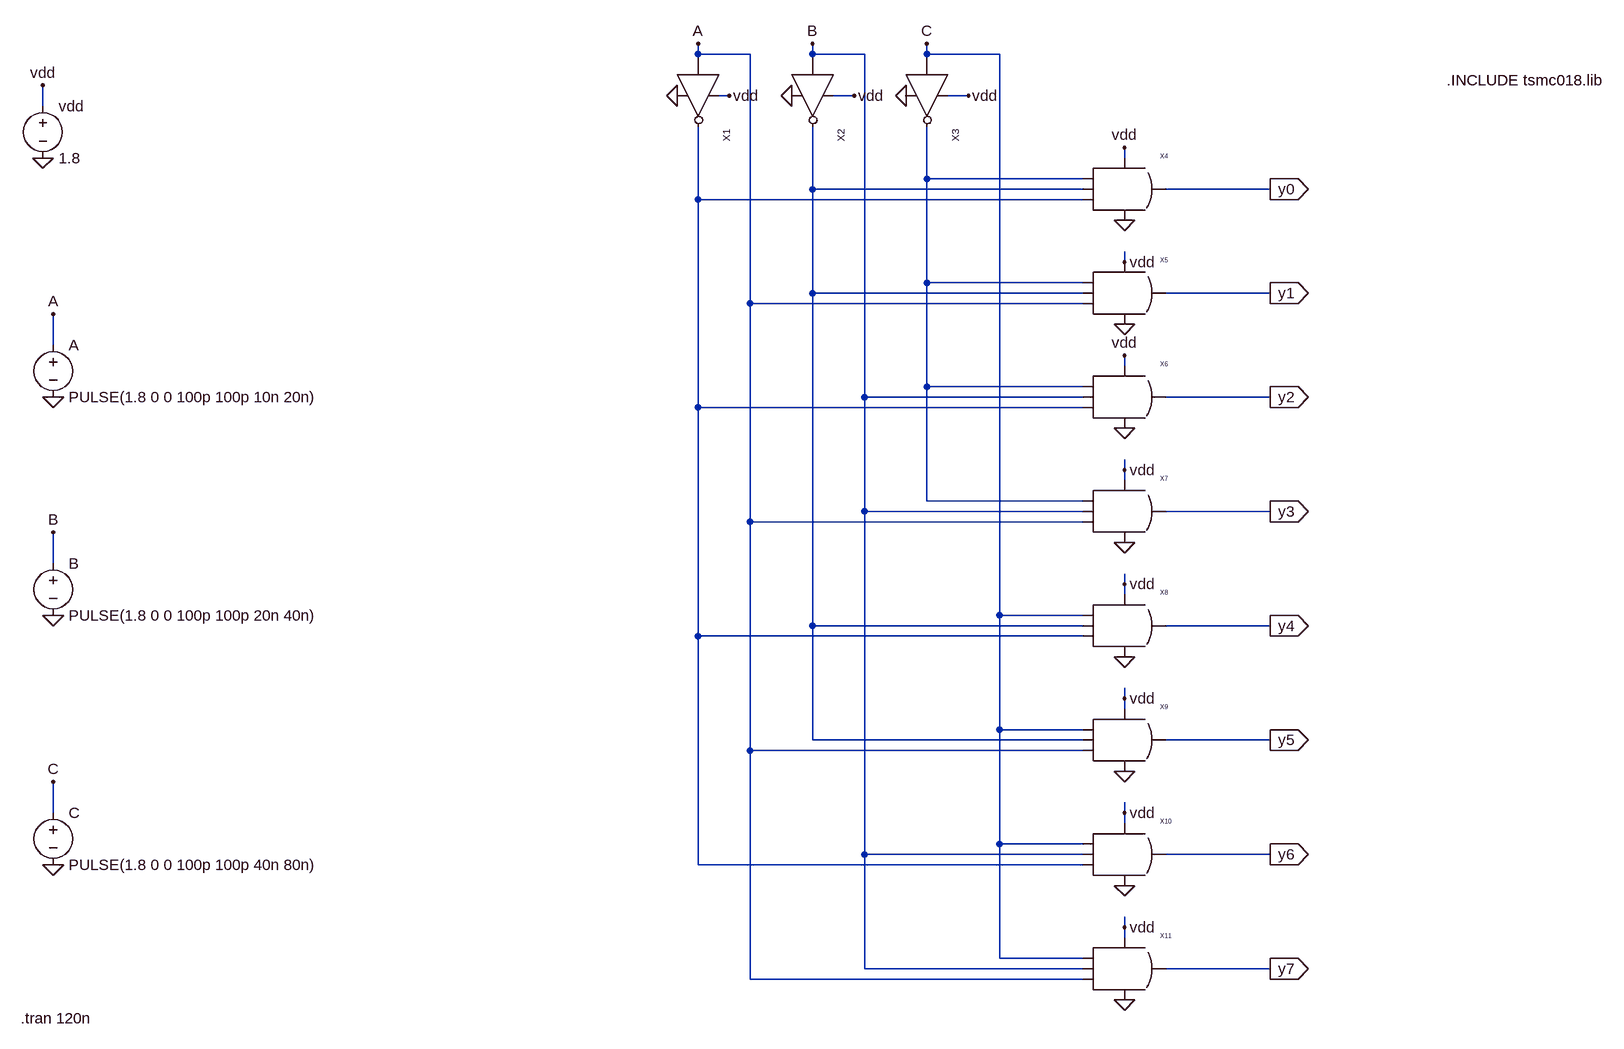
[diagram p0: schematic decoder_3_8.asc]
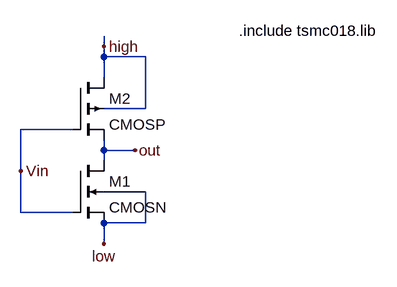
[diagram p1: sub-circuit inverter.asc]
decoder_3_8.asc, the LTspice schematic file:
Version 4
SHEET 1 1492 1500
WIRE 80 0 80 -16
WIRE 160 0 80 0
WIRE 256 0 256 -16
WIRE 336 0 256 0
WIRE 432 0 432 -16
WIRE 544 0 432 0
WIRE 128 64 112 64
WIRE 320 64 288 64
WIRE 496 64 464 64
WIRE -928 80 -928 48
WIRE 736 160 736 144
WIRE 432 192 432 112
WIRE 672 192 432 192
WIRE 256 208 256 112
WIRE 672 208 256 208
WIRE 960 208 800 208
WIRE 80 224 80 112
WIRE 672 224 80 224
WIRE 736 320 736 304
WIRE 432 352 432 192
WIRE 672 352 432 352
WIRE 256 368 256 208
WIRE 672 368 256 368
WIRE 960 368 800 368
WIRE 160 384 160 0
WIRE 672 384 160 384
WIRE -912 448 -912 400
WIRE 736 480 736 464
WIRE 432 512 432 352
WIRE 672 512 432 512
WIRE 336 528 336 0
WIRE 672 528 336 528
WIRE 960 528 800 528
WIRE 80 544 80 224
WIRE 672 544 80 544
WIRE 736 640 736 624
WIRE 736 656 736 640
WIRE 432 688 432 512
WIRE 672 688 432 688
WIRE 336 704 336 528
WIRE 672 704 336 704
WIRE 960 704 800 704
WIRE 160 720 160 384
WIRE 672 720 160 720
WIRE -912 784 -912 736
WIRE 736 816 736 800
WIRE 736 832 736 816
WIRE 544 864 544 0
WIRE 672 864 544 864
WIRE 256 880 256 368
WIRE 672 880 256 880
WIRE 960 880 800 880
WIRE 80 896 80 544
WIRE 672 896 80 896
WIRE 736 992 736 976
WIRE 736 1008 736 992
WIRE 544 1040 544 864
WIRE 672 1040 544 1040
WIRE 256 1056 256 880
WIRE 672 1056 256 1056
WIRE 960 1056 800 1056
WIRE 160 1072 160 720
WIRE 672 1072 160 1072
WIRE -912 1168 -912 1120
WIRE 736 1168 736 1152
WIRE 736 1184 736 1168
WIRE 544 1216 544 1040
WIRE 672 1216 544 1216
WIRE 336 1232 336 704
WIRE 672 1232 336 1232
WIRE 960 1232 800 1232
WIRE 80 1248 80 896
WIRE 672 1248 80 1248
WIRE 736 1344 736 1328
WIRE 736 1360 736 1344
WIRE 544 1392 544 1216
WIRE 672 1392 544 1392
WIRE 336 1408 336 1232
WIRE 672 1408 336 1408
WIRE 960 1408 800 1408
WIRE 160 1424 160 1072
WIRE 672 1424 160 1424
FLAG 224 64 0
FLAG 48 64 0
FLAG 400 64 0
FLAG 736 256 0
FLAG 736 416 0
FLAG 736 576 0
FLAG 736 752 0
FLAG 736 928 0
FLAG 736 1104 0
FLAG 736 1280 0
FLAG 736 1456 0
FLAG -928 160 0
FLAG -912 528 0
FLAG -912 864 0
FLAG -912 1248 0
FLAG -928 48 vdd
FLAG 128 64 vdd
FLAG 320 64 vdd
FLAG 496 64 vdd
FLAG 736 144 vdd
FLAG 736 320 vdd
FLAG 736 464 vdd
FLAG 736 640 vdd
FLAG 736 816 vdd
FLAG 736 992 vdd
FLAG 736 1168 vdd
FLAG 736 1344 vdd
FLAG -912 400 A
FLAG 80 -16 A
FLAG -912 736 B
FLAG 256 -16 B
FLAG -912 1120 C
FLAG 432 -16 C
FLAG 960 208 y0
IOPIN 960 208 Out
FLAG 960 368 y1
IOPIN 960 368 Out
FLAG 960 528 y2
IOPIN 960 528 Out
FLAG 960 704 y3
IOPIN 960 704 Out
FLAG 960 880 y4
IOPIN 960 880 Out
FLAG 960 1056 y5
IOPIN 960 1056 Out
FLAG 960 1232 y6
IOPIN 960 1232 Out
FLAG 960 1408 y7
IOPIN 960 1408 Out
SYMBOL Inverter 64 96 R90
SYMATTR InstName X1
SYMBOL Inverter 240 96 R90
SYMATTR InstName X2
SYMBOL Inverter 416 96 R90
SYMATTR InstName X3
SYMBOL and_3_input 752 224 R0
SYMATTR InstName X4
SYMBOL and_3_input 752 384 R0
SYMATTR InstName X5
SYMBOL and_3_input 752 544 R0
SYMATTR InstName X6
SYMBOL and_3_input 752 720 R0
SYMATTR InstName X7
SYMBOL and_3_input 752 896 R0
SYMATTR InstName X8
SYMBOL and_3_input 752 1072 R0
SYMATTR InstName X9
SYMBOL and_3_input 752 1248 R0
SYMATTR InstName X10
SYMBOL and_3_input 752 1424 R0
SYMATTR InstName X11
SYMBOL voltage -928 64 R0
WINDOW 123 0 0 Left 0
WINDOW 39 0 0 Left 0
SYMATTR InstName vdd
SYMATTR Value 1.8
SYMBOL voltage -912 432 R0
WINDOW 123 0 0 Left 0
WINDOW 39 0 0 Left 0
SYMATTR InstName A
SYMATTR Value PULSE(1.8 0 0 100p 100p 10n 20n)
SYMBOL voltage -912 768 R0
WINDOW 123 0 0 Left 0
WINDOW 39 0 0 Left 0
SYMATTR InstName B
SYMATTR Value PULSE(1.8 0 0 100p 100p 20n 40n)
SYMBOL voltage -912 1152 R0
WINDOW 123 0 0 Left 0
WINDOW 39 0 0 Left 0
SYMATTR InstName C
SYMATTR Value PULSE(1.8 0 0 100p 100p 40n 80n)
TEXT 1232 40 Left 2 !.INCLUDE tsmc018.lib
TEXT -962 1484 Left 2 !.tran 120n

inverter.asc, the sub-circuit schematic file:
Version 4
SHEET 1 880 680
WIRE 192 -16 192 -32
WIRE 192 0 192 -16
WIRE 256 0 192 0
WIRE 192 32 192 0
WIRE 256 80 256 0
WIRE 256 80 192 80
WIRE 144 112 64 112
WIRE 192 144 192 128
WIRE 240 144 192 144
WIRE 192 160 192 144
WIRE 64 176 64 112
WIRE 256 208 192 208
WIRE 64 240 64 176
WIRE 144 240 64 240
WIRE 256 256 256 208
WIRE 256 256 192 256
WIRE 192 288 192 256
FLAG 64 176 Vin
FLAG 192 -16 high
FLAG 192 288 low
FLAG 240 144 out
SYMBOL cmosn 144 160 R0
SYMATTR InstName M1
SYMATTR Value2 l=180n w=1u
SYMBOL cmosp 144 32 R0
SYMATTR InstName M2
SYMATTR Value2 l=180n w=1200n
TEXT 400 -40 Left 2 !.include tsmc018.lib

The netlist it stands for:
* decoder_3_8.asc
XX1 vdd 0 A N003 inverter
XX2 vdd 0 B N002 inverter
XX3 vdd 0 C N001 inverter
XX4 vdd 0 N001 N002 N003 y0 and_3_input  ; pins vdd vss a b c vout
XX5 vdd 0 N001 N002 A y1 and_3_input  ; pins vdd vss a b c vout
XX6 vdd 0 N001 B N003 y2 and_3_input  ; pins vdd vss a b c vout
XX7 vdd 0 N001 B A y3 and_3_input  ; pins vdd vss a b c vout
XX8 vdd 0 C N002 N003 y4 and_3_input  ; pins vdd vss a b c vout
XX9 vdd 0 C N002 A y5 and_3_input  ; pins vdd vss a b c vout
XX10 vdd 0 C B N003 y6 and_3_input  ; pins vdd vss a b c vout
XX11 vdd 0 C B A y7 and_3_input  ; pins vdd vss a b c vout
vdd vdd 0 1.8
V§A A 0 PULSE(1.8 0 0 100p 100p 10n 20n)
V§B B 0 PULSE(1.8 0 0 100p 100p 20n 40n)
V§C C 0 PULSE(1.8 0 0 100p 100p 40n 80n)

* block symbol definitions
.subckt inverter high low Vin out
M1 out Vin low low CMOSN l=180n w=1u
M2 high Vin out high CMOSP l=180n w=1200n
.include tsmc018.lib
.ends inverter

.model NMOS NMOS
.model PMOS PMOS
.lib standard.mos
.INCLUDE tsmc018.lib
.tran 120n
.backanno
.end

* Results of the author's LTspice run, read from the files saved beside the schematic
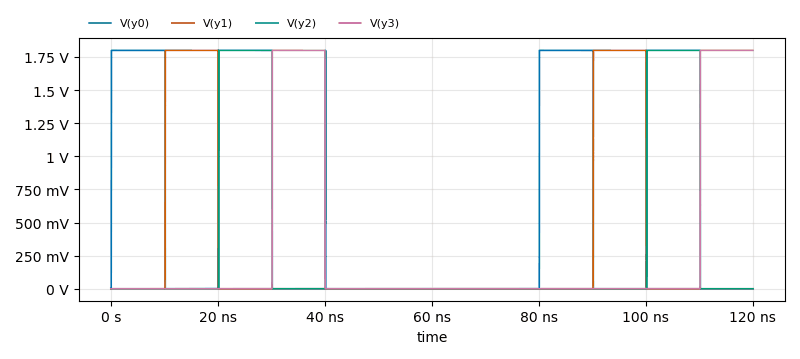
[diagram p2: Transient Analysis of decoder_3_8.asc, plotted from the saved traces]
* Transient Analysis, 1 run:
*   V(y0): min 0 V, max 1.8 V, average 305.9 mV, rms 741.8 mV, last 0 V
*   V(y1): min 0 V, max 1.8 V, average 296.6 mV, rms 730.4 mV, last 0 V
*   V(y2): min 0 V, max 1.8 V, average 300 mV, rms 734.7 mV, last 0 V
*   V(y3): min 0 V, max 1.8 V, average 295.8 mV, rms 729.5 mV, last 1.8 V